# Altium schematic sheet FPGA_LVDS.SchDoc: Humpback
size 420 x 297 mm; EDA_Number: ARTIQ; Projet: Humpback; Author: G.Kasprowicz; CompanyName: WUT ISE; DrawnBy: G.Kasprowicz; Organization: WUT ISE; Address1: PW ISE; Address2: Nowowiejska 15/19 00-665 Warsaw; Address3: gkasprow@gmail.com; DocumentNumber: 3; Revision: 1.0; SheetNumber: 3; SheetTotal: 11; ModifiedBy: -; CheckedDate: -; Title2: FPGA LVDS bank v1.0; DivGrp: WUT ISE; Designer: G.Kasprowicz; ModifiedDate: -; ProjectName: Sensor Box
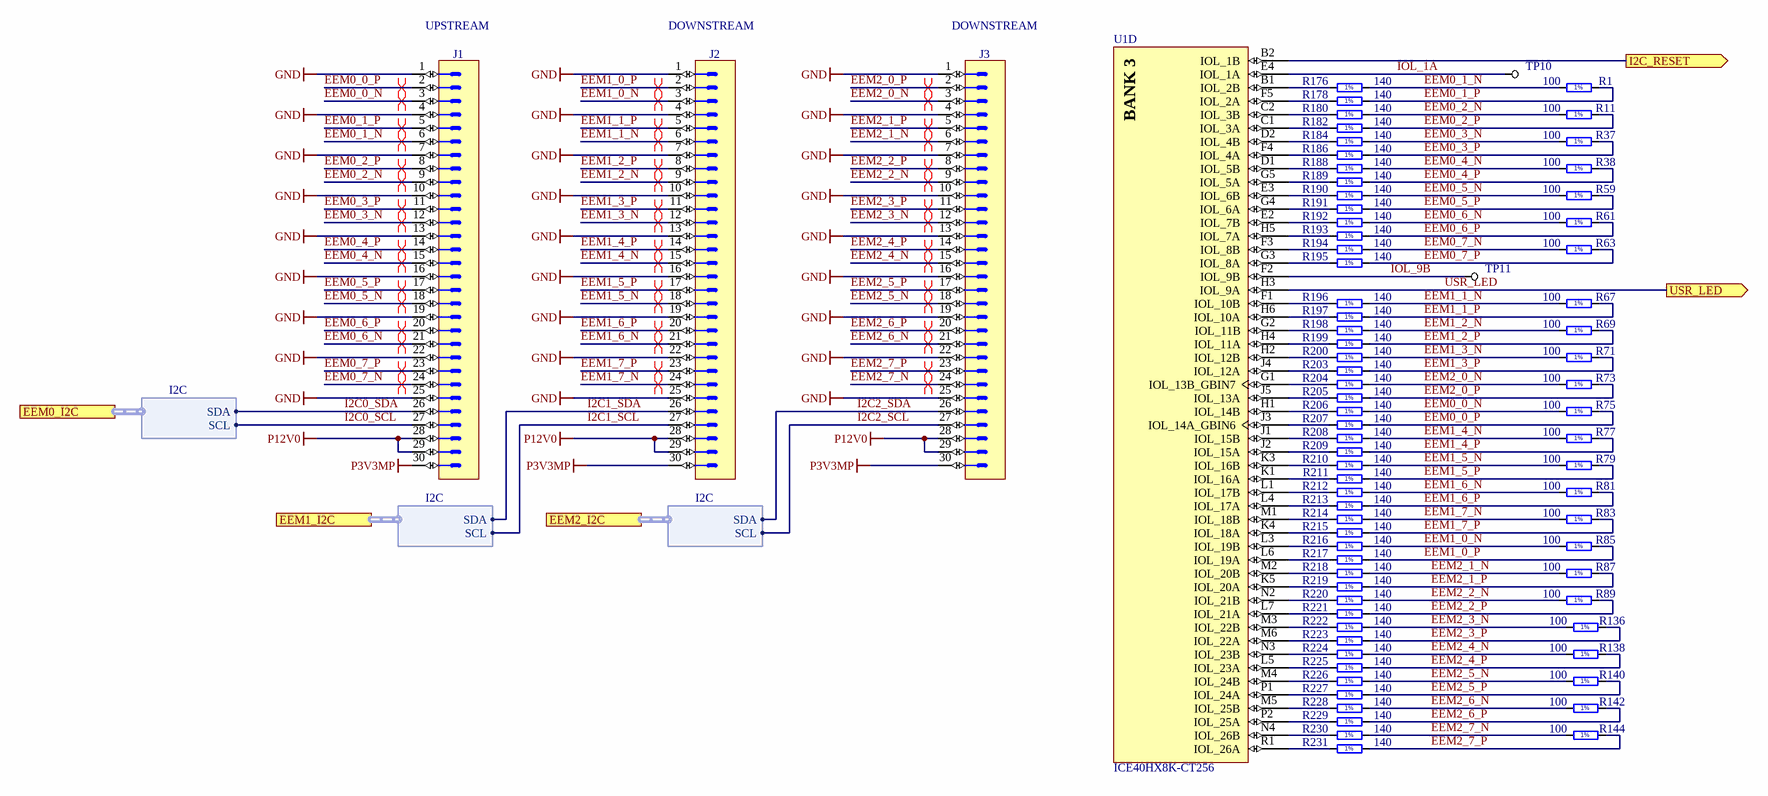
[diagram p0: FPGA_LVDS.SchDoc]

## Parts
J1  (no value)  [3M_N2530-6002RB]
J2  (no value)  [3M_N2530-6002RB]
J3  (no value)  [3M_N2530-6002RB]
R1  100  [RESC1005X40N]
R11  100  [RESC1005X40N]
R37  100  [RESC1005X40N]
R38  100  [RESC1005X40N]
R59  100  [RESC1005X40N]
R61  100  [RESC1005X40N]
R63  100  [RESC1005X40N]
R67  100  [RESC1005X40N]
R69  100  [RESC1005X40N]
R71  100  [RESC1005X40N]
R73  100  [RESC1005X40N]
R75  100  [RESC1005X40N]
R77  100  [RESC1005X40N]
R79  100  [RESC1005X40N]
R81  100  [RESC1005X40N]
R83  100  [RESC1005X40N]
R85  100  [RESC1005X40N]
R87  100  [RESC1005X40N]
R89  100  [RESC1005X40N]
R136  100  [RESC1005X40N]
R138  100  [RESC1005X40N]
R140  100  [RESC1005X40N]
R142  100  [RESC1005X40N]
R144  100  [RESC1005X40N]
R176  140  [RESC0603X28N]
R178  140  [RESC0603X28N]
R180  140  [RESC0603X28N]
R182  140  [RESC0603X28N]
R184  140  [RESC0603X28N]
R186  140  [RESC0603X28N]
R188  140  [RESC0603X28N]
R189  140  [RESC0603X28N]
R190  140  [RESC0603X28N]
R191  140  [RESC0603X28N]
R192  140  [RESC0603X28N]
R193  140  [RESC0603X28N]
R194  140  [RESC0603X28N]
R195  140  [RESC0603X28N]
R196  140  [RESC0603X28N]
R197  140  [RESC0603X28N]
R198  140  [RESC0603X28N]
R199  140  [RESC0603X28N]
R200  140  [RESC0603X28N]
R203  140  [RESC0603X28N]
R204  140  [RESC0603X28N]
R205  140  [RESC0603X28N]
R206  140  [RESC0603X28N]
R207  140  [RESC0603X28N]
R208  140  [RESC0603X28N]
R209  140  [RESC0603X28N]
R210  140  [RESC0603X28N]
R211  140  [RESC0603X28N]
R212  140  [RESC0603X28N]
R213  140  [RESC0603X28N]
R214  140  [RESC0603X28N]
R215  140  [RESC0603X28N]
R216  140  [RESC0603X28N]
R217  140  [RESC0603X28N]
R218  140  [RESC0603X28N]
R219  140  [RESC0603X28N]
R220  140  [RESC0603X28N]
R221  140  [RESC0603X28N]
R222  140  [RESC0603X28N]
R223  140  [RESC0603X28N]
R224  140  [RESC0603X28N]
R225  140  [RESC0603X28N]
R226  140  [RESC0603X28N]
R227  140  [RESC0603X28N]
R228  140  [RESC0603X28N]
R229  140  [RESC0603X28N]
R230  140  [RESC0603X28N]
R231  140  [RESC0603X28N]
TP10  TP  [TP]  (value not drawn)
TP11  TP  [TP]  (value not drawn)
U1  ICE40HX8K-CT256  [LATC-caBGA-256]  (part D of 5)

## Ports
EEM0_I2C (harness I2C), EEM1_I2C (harness I2C), EEM2_I2C (harness I2C), I2C_RESET (out), USR_LED (out)

## Harnesses
I2C: SDA, SCL

## Nets
GND: J1.1 J1.4 J1.7 J1.10 J1.13 J1.16 J1.19 J1.22 J1.25 J2.1 J2.4 J2.7 J2.10 J2.13 J2.16 J2.19 J2.22 J2.25 J3.1 J3.4 J3.7 J3.10 J3.13 J3.16 J3.19 J3.22 J3.25
P3V3MP: J1.30 J2.30 J3.30
P12V0: J1.28 J1.29 J2.28 J2.29 J3.28 J3.29
EEM0_0_N: J1.3 R75.1 R206.2
EEM0_0_P: J1.2 R75.2 R207.2
EEM0_1_N: J1.6 R1.1 R176.2
EEM0_1_P: J1.5 R1.2 R178.2
EEM0_2_N: J1.9 R11.1 R180.2
EEM0_2_P: J1.8 R11.2 R182.2
EEM0_3_N: J1.12 R37.1 R184.2
EEM0_3_P: J1.11 R37.2 R186.2
EEM0_4_N: J1.15 R38.1 R188.2
EEM0_4_P: J1.14 R38.2 R189.2
EEM0_5_N: J1.18 R59.1 R190.2
EEM0_5_P: J1.17 R59.2 R191.2
EEM0_6_N: J1.21 R61.1 R192.2
EEM0_6_P: J1.20 R61.2 R193.2
EEM0_7_N: J1.24 R63.1 R194.2
EEM0_7_P: J1.23 R63.2 R195.2
EEM1_0_N: J2.3 R85.1 R216.2
EEM1_0_P: J2.2 R85.2 R217.2
EEM1_1_N: J2.6 R67.1 R196.2
EEM1_1_P: J2.5 R67.2 R197.2
EEM1_2_N: J2.9 R69.1 R198.2
EEM1_2_P: J2.8 R69.2 R199.2
EEM1_3_N: J2.12 R71.1 R200.2
EEM1_3_P: J2.11 R71.2 R203.2
EEM1_4_N: J2.15 R77.1 R208.2
EEM1_4_P: J2.14 R77.2 R209.2
EEM1_5_N: J2.18 R79.1 R210.2
EEM1_5_P: J2.17 R79.2 R211.2
EEM1_6_N: J2.21 R81.1 R212.2
EEM1_6_P: J2.20 R81.2 R213.2
EEM1_7_N: J2.24 R83.1 R214.2
EEM1_7_P: J2.23 R83.2 R215.2
EEM2_0_N: J3.3 R73.1 R204.2
EEM2_0_P: J3.2 R73.2 R205.2
EEM2_1_N: J3.6 R87.1 R218.2
EEM2_1_P: J3.5 R87.2 R219.2
EEM2_2_N: J3.9 R89.1 R220.2
EEM2_2_P: J3.8 R89.2 R221.2
EEM2_3_N: J3.12 R136.1 R222.2
EEM2_3_P: J3.11 R136.2 R223.2
EEM2_4_N: J3.15 R138.1 R224.2
EEM2_4_P: J3.14 R138.2 R225.2
EEM2_5_N: J3.18 R140.1 R226.2
EEM2_5_P: J3.17 R140.2 R227.2
EEM2_6_N: J3.21 R142.1 R228.2
EEM2_6_P: J3.20 R142.2 R229.2
EEM2_7_N: J3.24 R144.1 R230.2
EEM2_7_P: J3.23 R144.2 R231.2
I2C0_SCL: J1.27 ; port EEM0_I2C.SCL
I2C0_SDA: J1.26 ; port EEM0_I2C.SDA
I2C1_SCL: J2.27 ; port EEM1_I2C.SCL
I2C1_SDA: J2.26 ; port EEM1_I2C.SDA
I2C2_SCL: J3.27 ; port EEM2_I2C.SCL
I2C2_SDA: J3.26 ; port EEM2_I2C.SDA
I2C_RESET: U1.B2(IOL_1B) ; port I2C_RESET
IOL_1A: TP10.1 U1.E4(IOL_1A)
IOL_9B: TP11.1 U1.F2(IOL_9B)
USR_LED: U1.H3(IOL_9A) ; port USR_LED
NetR176_1: R176.1 U1.B1(IOL_2B)
NetR178_1: R178.1 U1.F5(IOL_2A)
NetR180_1: R180.1 U1.C2(IOL_3B)
NetR182_1: R182.1 U1.C1(IOL_3A)
NetR184_1: R184.1 U1.D2(IOL_4B)
NetR186_1: R186.1 U1.F4(IOL_4A)
NetR188_1: R188.1 U1.D1(IOL_5B)
NetR189_1: R189.1 U1.G5(IOL_5A)
NetR190_1: R190.1 U1.E3(IOL_6B)
NetR191_1: R191.1 U1.G4(IOL_6A)
NetR192_1: R192.1 U1.E2(IOL_7B)
NetR193_1: R193.1 U1.H5(IOL_7A)
NetR194_1: R194.1 U1.F3(IOL_8B)
NetR195_1: R195.1 U1.G3(IOL_8A)
NetR196_1: R196.1 U1.F1(IOL_10B)
NetR197_1: R197.1 U1.H6(IOL_10A)
NetR198_1: R198.1 U1.G2(IOL_11B)
NetR199_1: R199.1 U1.H4(IOL_11A)
NetR200_1: R200.1 U1.H2(IOL_12B)
NetR203_1: R203.1 U1.J4(IOL_12A)
NetR204_1: R204.1 U1.G1(IOL_13B_GBIN7)
NetR205_1: R205.1 U1.J5(IOL_13A)
NetR206_1: R206.1 U1.H1(IOL_14B)
NetR207_1: R207.1 U1.J3(IOL_14A_GBIN6)
NetR208_1: R208.1 U1.J1(IOL_15B)
NetR209_1: R209.1 U1.J2(IOL_15A)
NetR210_1: R210.1 U1.K3(IOL_16B)
NetR211_1: R211.1 U1.K1(IOL_16A)
NetR212_1: R212.1 U1.L1(IOL_17B)
NetR213_1: R213.1 U1.L4(IOL_17A)
NetR214_1: R214.1 U1.M1(IOL_18B)
NetR215_1: R215.1 U1.K4(IOL_18A)
NetR216_1: R216.1 U1.L3(IOL_19B)
NetR217_1: R217.1 U1.L6(IOL_19A)
NetR218_1: R218.1 U1.M2(IOL_20B)
NetR219_1: R219.1 U1.K5(IOL_20A)
NetR220_1: R220.1 U1.N2(IOL_21B)
NetR221_1: R221.1 U1.L7(IOL_21A)
NetR222_1: R222.1 U1.M3(IOL_22B)
NetR223_1: R223.1 U1.M6(IOL_22A)
NetR224_1: R224.1 U1.N3(IOL_23B)
NetR225_1: R225.1 U1.L5(IOL_23A)
NetR226_1: R226.1 U1.M4(IOL_24B)
NetR227_1: R227.1 U1.P1(IOL_24A)
NetR228_1: R228.1 U1.M5(IOL_25B)
NetR229_1: R229.1 U1.P2(IOL_25A)
NetR230_1: R230.1 U1.N4(IOL_26B)
NetR231_1: R231.1 U1.R1(IOL_26A)

## Layout directives
differential pair: EEM0_0_N, EEM0_0_P, EEM0_1_N, EEM0_1_P, EEM0_2_N, EEM0_2_P, EEM0_3_N, EEM0_3_P, EEM0_4_N, EEM0_4_P, EEM0_5_N, EEM0_5_P, EEM0_6_N, EEM0_6_P, EEM0_7_N, EEM0_7_P, EEM1_0_N, EEM1_0_P, EEM1_1_N, EEM1_1_P, EEM1_2_N, EEM1_2_P, EEM1_3_N, EEM1_3_P, EEM1_4_N, EEM1_4_P, EEM1_5_N, EEM1_5_P, EEM1_6_N, EEM1_6_P, EEM1_7_N, EEM1_7_P, EEM2_0_N, EEM2_0_P, EEM2_1_N, EEM2_1_P, EEM2_2_N, EEM2_2_P, EEM2_3_N, EEM2_3_P, EEM2_4_N, EEM2_4_P, EEM2_5_N, EEM2_5_P, EEM2_6_N, EEM2_6_P, EEM2_7_N, EEM2_7_P

## Notes on the sheet
- (near J1) UPSTREAM
- (near J2) DOWNSTREAM
- (near J3) DOWNSTREAM
- Project/Equipment
- Document
- Designer
- Drawn by
- Check.by
- Copyright WUT ISE 2018.
  This documentation describes Open Hardware and is licensed under the CERN OHL v.1.1. You may redistribute and modify this documentation under the terms of the CERN OHL v.1.1. (http://ohwr.org/CERNOHL). This documentation is distributed WITHOUT ANY EXPRESS OR IMPLIED WARRANTY, INCLUDING OF MERCHANTABILITY, SATISFACTORY QUALITY AND FITNESS FOR A PARTICULAR PURPOSE. Please see the CERN OHL v.1.1 for applicable conditions.
- Contact
- File
- Last Mod.
- Print Date
- Sheet
- Size
- A3
- of
- Rev
- (in symbol CMP-0962-00001-1, part D) BANK 3
- (in symbol R0201_140R_1%_0.05W_200PPM) 1%
- (in symbol R0402_100R_1%_0.0625W_100PPM) 1%

## Library data of the parts
J1-J3 = 3M_N2530-6002RB: Connector 30 Male; Part Description: 30 Contacts - Straight .100'' x .100'' Low Profile Four-Wall Header, 2500 Series; Manufacturer: 3M; PressFit: No; Part Number: 3M_N2530-6002RB; Component Kind: Standard; Component Type: Standard; Pin Count: 30; Family: Header 30; Mounted: Yes; Socket: No; SMD: No; Sense: No; Status: None; Manufacturer Part Number: N2530-6002RB; ComponentHeight: 10.03mm; HelpURL: \\cern.ch\dfs\Applications\Altium\Datasheets\3M_N2530-6002RB.pdf; Author: CERN DEM JLC; CreateDate: 11.02.2009; LatestRevisionDate: 11.08.2009
R1 R11 R37 R38 R59 R61 R63 R67 R69 R71 R73 R75 R77 R79 R81 R83 R85 R87 R89 R136 R138 R140 R142 R144 = R0402_100R_1%_0.0625W_100PPM: Resistor - 1%; Part Description: General Purpose Thick Film Chip Resistor; Manufacturer: GENERIC; Manufacturer1 Part Number: 232270671001L; TC: ±100ppm/°C; PressFit: No; Part Number: R0402_100R_1%_0.0625W_100PPM; Component Kind: Standard; Component Type: Standard; Pin Count: 2; Value: 100; Status: Not Recommended; Power: 0.0625W; Tolerance: ±1%; Manufacturer Part Number: R0402_100R_1%_0.0625W_100PPM; Case: 0402; Mounted: Yes; Sense: No; Socket: No; SMD: Yes; Manufacturer1 Example: YAGEO PHYCOMP; Manufacturer1 ComponentHeight: 0.4mm; HelpURL: \\cern.ch\dfs\Applications\Altium\Datasheets\R0402_Phycomp_RC0402.pdf; Author: CERN DEM JLC; CreateDate: 03/12/2007; LatestRevisionDate: 17/10/2012
R176 R178 R180 R182 R184 R186 R188-R200 R203-R231 = R0201_140R_1%_0.05W_200PPM: Resistor - 1%; Part Description: Thick Film Chip Resistor; Manufacturer: GENERIC; Manufacturer1 Part Number: CRCW0201140RFNED; Power: 0.05W; TC: ±200ppm/°C; PressFit: No; Part Number: R0201_140R_1%_0.05W_200PPM; Component Kind: Standard; Component Type: Standard; Pin Count: 2; Value: 140; Status: Not Recommended; Tolerance: ±1%; Manufacturer Part Number: R0201_140R_1%_0.05W_200PPM; Case: 0201; Mounted: Yes; Sense: No; Socket: No; SMD: Yes; Manufacturer1 Example: VISHAY; Manufacturer1 ComponentHeight: 0.27mm; HelpURL: \\cern.ch\dfs\Applications\Altium\Datasheets\R0201_VISHAY_CRCW e3.pdf; Author: CERN DEM MR; CreateDate: 26/01/2016; LatestRevisionDate: 26/01/2016
TP10 TP11 = TP: Testpoint
U1 = CMP-0962-00001-1: iCE40 HX8K Series FPGA Family, 7680 Logic Cells, 1.2 V Core, 128 K Embedded RAM Bits, 256-ball caBGA, Pb-Free, Tray; Manufacturer: Lattice Semiconductor; Supply Voltage: 1.2V; Phase-Locked Loops: 2; Logic Cells: 7680; Embedded RAM Bits: 128K; PackageReference: caBGA-256; PackageDescription: 256-Ball Chip Array Ball Grid Array, Body 14 x 14 mm, Pitch 0.8 mm; RoHS: TRUE; Packing: Tray; Mounting Technology: Surface Mount; ComponentLink3URL: http://www.latticesemi.com/lit/docs/package/pkg.pdf; ComponentLink1Description: Manufacturer URL; ComponentLink3Description: Package Specification; Code_JEDEC: MO-275; PackageVersion: Rev. 03.9, 02/2013; ComponentLink1URL: http://www.latticesemi.com/en; ComponentLink2URL: http://www.latticesemi.com/~/media/Documents/DataSheets/iCE/iCE40LPHXFamilyDataSheet.pdf; PartNumber: ICE40HX8K-CT256; ComponentLink2Description: Datasheet; DatasheetVersion: Rev. 02.9